# Altium project PCB to AtMega328p.PrjPcb
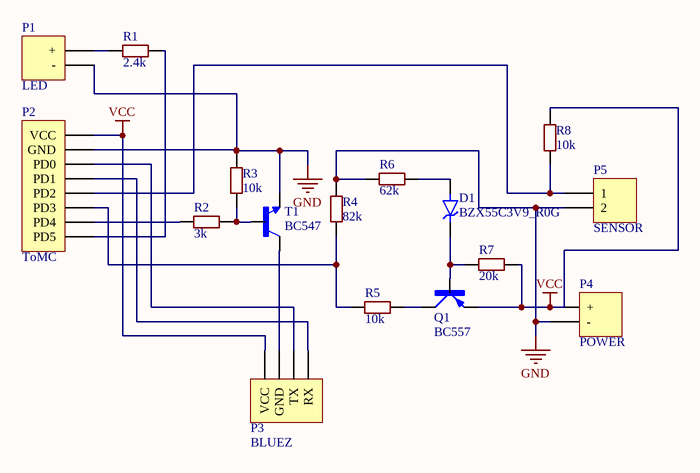
[diagram p0: ForAtmega328P.SchDoc]
1 sheet, 16 parts. Net scope: global (net labels, ports and power ports of the same name join across sheets).
Board file: For_Atmega328P.PcbDoc

## Sheet ForAtmega328P.SchDoc
size A4; SheetNumber: 1; SheetTotal: 1

### Parts
D1  BZX55C3V9_R0G  [DIOAD928W47L399D179]
P1  LED  [HDR1X2]
P2  ToMC  [HDR1X8]
P3  BLUEZ  [HDR1X4]
P4  POWER  [HDR1X2]
P5  SENSOR  [HDR1X2]
Q1  BC557  [SOT54A]
R1  2.4k  [Res]
R2  3k  [Res]
R3  10k  [Res]
R4  82k  [Res]
R5  10k  [Res]
R6  62k  [Res]
R7  20k  [Res]
R8  10k  [Res]
T1  BC547  [TO92]

### Nets
GND: P1.2(-) P2.2(GND) P4.2(-) P5.2 R3.2 R4.2 R6.1 T1.1(E)
VCC: P2.1(VCC) P3.1(VCC) P4.1(+) Q1.E R7.2 R8.1
NetD1_A: D1.A R6.2
NetD1_C: D1.C(K) Q1.B R7.1
NetP1_1: P1.1(+) R1.1
NetP2_3: P2.3(PD0) P3.3(TX)
NetP2_4: P2.4(PD1) P3.4(RX)
NetP2_5: P2.5(PD2) P5.1 R8.2
NetP2_6: P2.6(PD3) R4.1 R5.1
NetP2_7: P2.7(PD4) R2.1
NetP2_8: P2.8(PD5) R1.2
NetP3_2: P3.2(GND) T1.3(C)
NetQ1_C: Q1.C R5.2
NetR2_2: R2.2 R3.1 T1.2(B)

### Library data of the parts
D1 = BZX55C3V9_R0G: MP: altium_native_batch; Value: *; Package: None; Price: None; Availability: Unavailable
P1 P4 P5 = Header 2: Header, 2-Pin; LatestRevisionDate: 17-Jul-2002; LatestRevisionNote: Re-released for DXP Platform.; Publisher: Altium Limited
P2 = Header 8: Header, 8-Pin; LatestRevisionDate: 17-Jul-2002; LatestRevisionNote: Re-released for DXP Platform.; Publisher: Altium Limited
P3 = Header 4: Header, 4-Pin; LatestRevisionDate: 17-Jul-2002; LatestRevisionNote: Re-released for DXP Platform.; Publisher: Altium Limited
Q1 = BC557: Bipolar (BJT) Transistor PNP 45 V 100 mA 320MHz 625 mW Through Hole TO-92 (TO-226); MF: ON Semiconductor; SnapEDA_Link: https://www.snapeda.com/parts/BC557/Onsemi/view-part/?ref=snap; Package: E-PKG AXIAL-LEADED-2 ON Semiconductor; MP: BC557; Check_prices: https://www.snapeda.com/parts/BC557/Onsemi/view-part/?ref=eda; Purchase-URL: https://pricing.snapeda.com/search/part/BC557/?ref=eda; Price: None; Value: *; Availability: In Stock
R1-R8 = Res
T1 = BC547: Trans GP BJT NPN 45V 0.1A 500mW 3-Pin TO-92 T/R; MF: ON Semiconductor; Package: None; MP: BC547; Check_prices: https://www.snapeda.com/parts/BC547/Onsemi/view-part/?ref=eda; Value: *; SnapEDA_Link: https://www.snapeda.com/parts/BC547/Onsemi/view-part/?ref=snap; Availability: In Stock; Price: None; Purchase-URL: https://pricing.snapeda.com/search/part/BC547/?ref=eda